# EAGLE design db9snes (EAGLE 9.0.0)
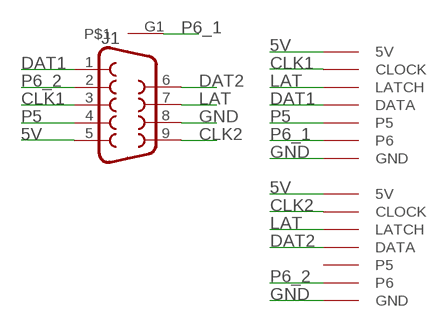
[diagram p0: schematic, sheet 1]

## Parts
J1  DB9FEMALE  [DB9]
U$1  GAMEPAD-CONN_SNESCONN  [GAMEPAD-CONN_SNESCONN]
U$3  GAMEPAD-CONN_SNESCONN  [GAMEPAD-CONN_SNESCONN]

## Nets
5V: J1.5 U$1.5V U$3.5V
CLK1: J1.3 U$3.CLOCK
CLK2: J1.9 U$1.CLOCK
DAT1: J1.1 U$3.DATA
DAT2: J1.6 U$1.DATA
GND: J1.8 U$1.GND U$3.GND
LAT: J1.7 U$1.LATCH U$3.LATCH
P5: J1.4 U$3.P5
P6_1: J1.G1 U$3.P6
P6_2: J1.2 U$1.P6
Unconnected: U$1.P5

## Library data of the parts
J1 = SparkFun-Connectors:DB9: DB9 Connector Standard DB9 (D-Sub 9) serial connector. Can be used for CAN bus as well as RS485 and RS232. Footprint production proven. Here is the female version connector we sell at SparkFun: 9 Pin Female Serial Connector - PCB Mount <https://www.sparkfun.com/products/429> (PRT-00429) This connector has been used on the following SparkFun products: SparkFun RS232 Shifter - SMD <https://www.sparkfun.com/products/449> (PRT-00449) SparkFun RS232 Shifter SMD (No DB9) <https://www.sparkfun.com/products/8780> (PRT-08780); PROD_ID: CONN-08194
U$1 U$3 = db9snes:GAMEPAD-CONN_SNESCONN

## Board
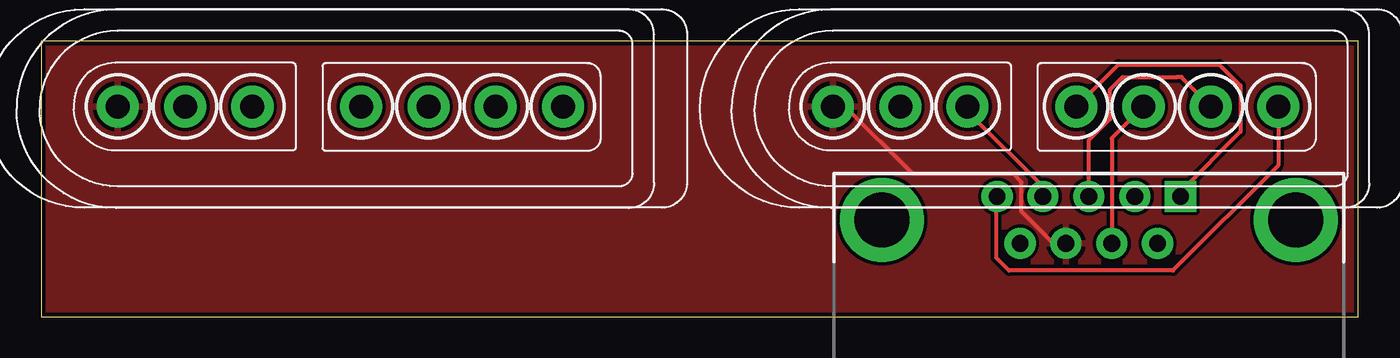
[diagram p1: board, top side]
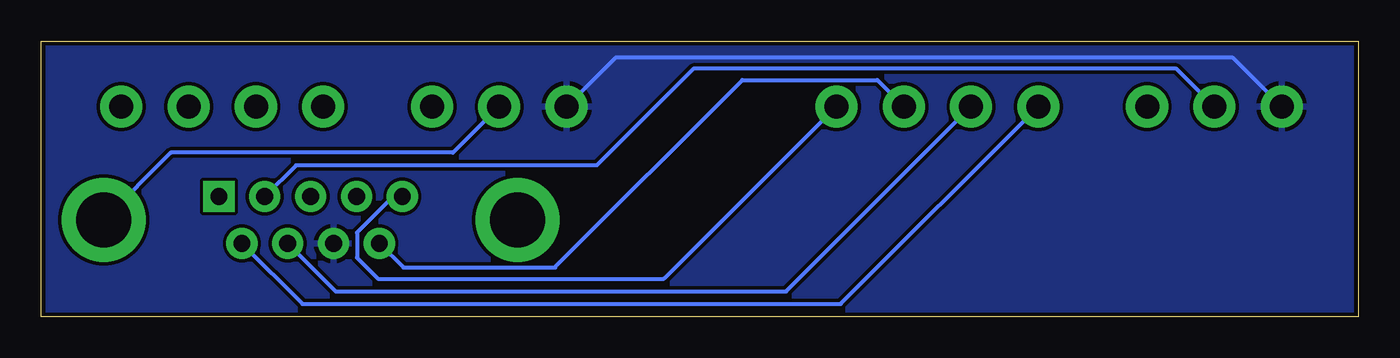
[diagram p2: board, bottom side, seen from below]

Size 79.5 x 16.64 mm. Coordinates in mm from the lower left corner, seen from the top.
Outline: 79.5,16.64 0,16.64 0,0 79.5,0 79.5,16.64
Copper layers (1*16): Top 0.035mm / dielectric 1.5mm / Bottom 0.035mm
Design rules "default *": minimum track width 10mil, minimum drill 24mil, track to track 8mil, track to pad 8mil, pad to pad 8mil, via to via 8mil, smd to smd 8mil, copper to edge 10mil, drill to drill 8mil, minimum pad ring 10mil, minimum via ring 8mil, stop-mask expansion 4mil, vias tented up to drill 0mil, thermal gap 10mil

### Footprints (pad centres in the part's own frame; a part is rotated, then mirrored left to right if it is on the bottom)
DB9 = drill 1.016 pad 1.88 square: 1 -5.54,-1.42 | drill 1.016 pad 1.88: 2 -2.77,-1.42; 3 0,-1.42; 4 2.77,-1.42; 5 5.54,-1.42; 6 -4.15,1.42; 7 -1.38,1.42; 8 1.38,1.42; 9 4.15,1.42 | drill 3.302 pad 5.08: G1 -12.5,0; G2 12.5,0
GAMEPAD-CONN_SNESCONN = drill 1.448 pad 2.54: 5V 0,4.064; CLOCK 4.064,4.064; DATA 12.192,4.064; GND 26.884,4.064; LATCH 8.128,4.064; P5 18.756,4.064; P6 22.82,4.064

### Placement (x,y rotation side)
J1  63.25,5.84 180 top
U$1  31.5,16.76 180 top
U$3  74.68,16.76 180 top

### Tracks (layer width: path | path; a pad name or v marks a point on that pad's centre or on a via)
5V
  Top 0.254: J1.5 57.66,7.21 57.66,3.56 58.42,2.79 68.33,2.79 74.68,9.14 U$3.5V
  Bottom 0.254: J1.5 58.27,7.26 60.45,5.08 60.45,3.56 59.18,2.29 41.91,2.29 U$1.5V
CLK1
  Top 0.254: J1.3 63.25,10.67 64.52,11.94 64.52,13.72 65.28,14.48 68.58,14.48 68.83,14.48 U$3.CLOCK
CLK2
  Bottom 0.254: J1.9 57.65,2.97 48.51,2.97 | 48.51,2.97 48.46,2.97 | 48.51,2.97 37.19,14.3 29.03,14.3 U$1.CLOCK
DAT1
  Top 0.254: J1.1 68.79,7.57 72.39,11.18 72.39,13.97 71.12,15.24 65.02,15.24 U$3.DATA
DAT2
  Bottom 0.254: U$1.DATA 31.24,0.76 63.74,0.76 J1.6
GND
  Top 0.254: J1.8 61.11,4.42 59.18,6.35 59.18,8.13 58.67,8.64 52.58,8.64 48.51,12.7 U$3.GND
  Bottom 0.254: U$3.GND 44.85,15.64 7.55,15.64 U$1.GND
  pour Top: 0.25,0.25 79.25,0 79.25,16.26 0.25,16.51
  pour Bottom: 0.25,0.25 79.25,0 79.25,16.26 0.25,16.51
LAT
  Top 0.254: J1.7 64.63,10.78 U$3.LATCH
  Bottom 0.254: J1.7 61.73,1.52 34.54,1.52 U$1.LATCH
P5
  Top 0.254: J1.4 60.48,7.85 55.92,12.41 U$3.P5
P6_1
  Bottom 0.254: U$3.P6 54.65,9.91 71.68,9.91 J1.G1
P6_2
  Bottom 0.254: U$1.P6 10.96,14.99 40.13,14.99 45.97,9.14 64.13,9.14 J1.2